# Altium schematic sheet GroundsCoupling.SchDoc: FMC SDR Frontend
size 420 x 297 mm; CheckedBy: -; CompanyName: CERN; DrawnBy: DrawnBy; Organization: CERN; Address1: European Organization for Nuclear Research; Address2: CH-1211 Genčve 23 - Switzerland; Revision: -; SheetNumber: -; SheetTotal: -; EDA_Number: EDA-XXXXX-VX-X; Projet: -; ModifiedBy: -; CreateDate: XX/XX/XXXX; CheckedDate: -; Title2: Grounds and Shield Coupling; DivGrp: TE/MPE; Designer: Designer; ModifiedDate: -
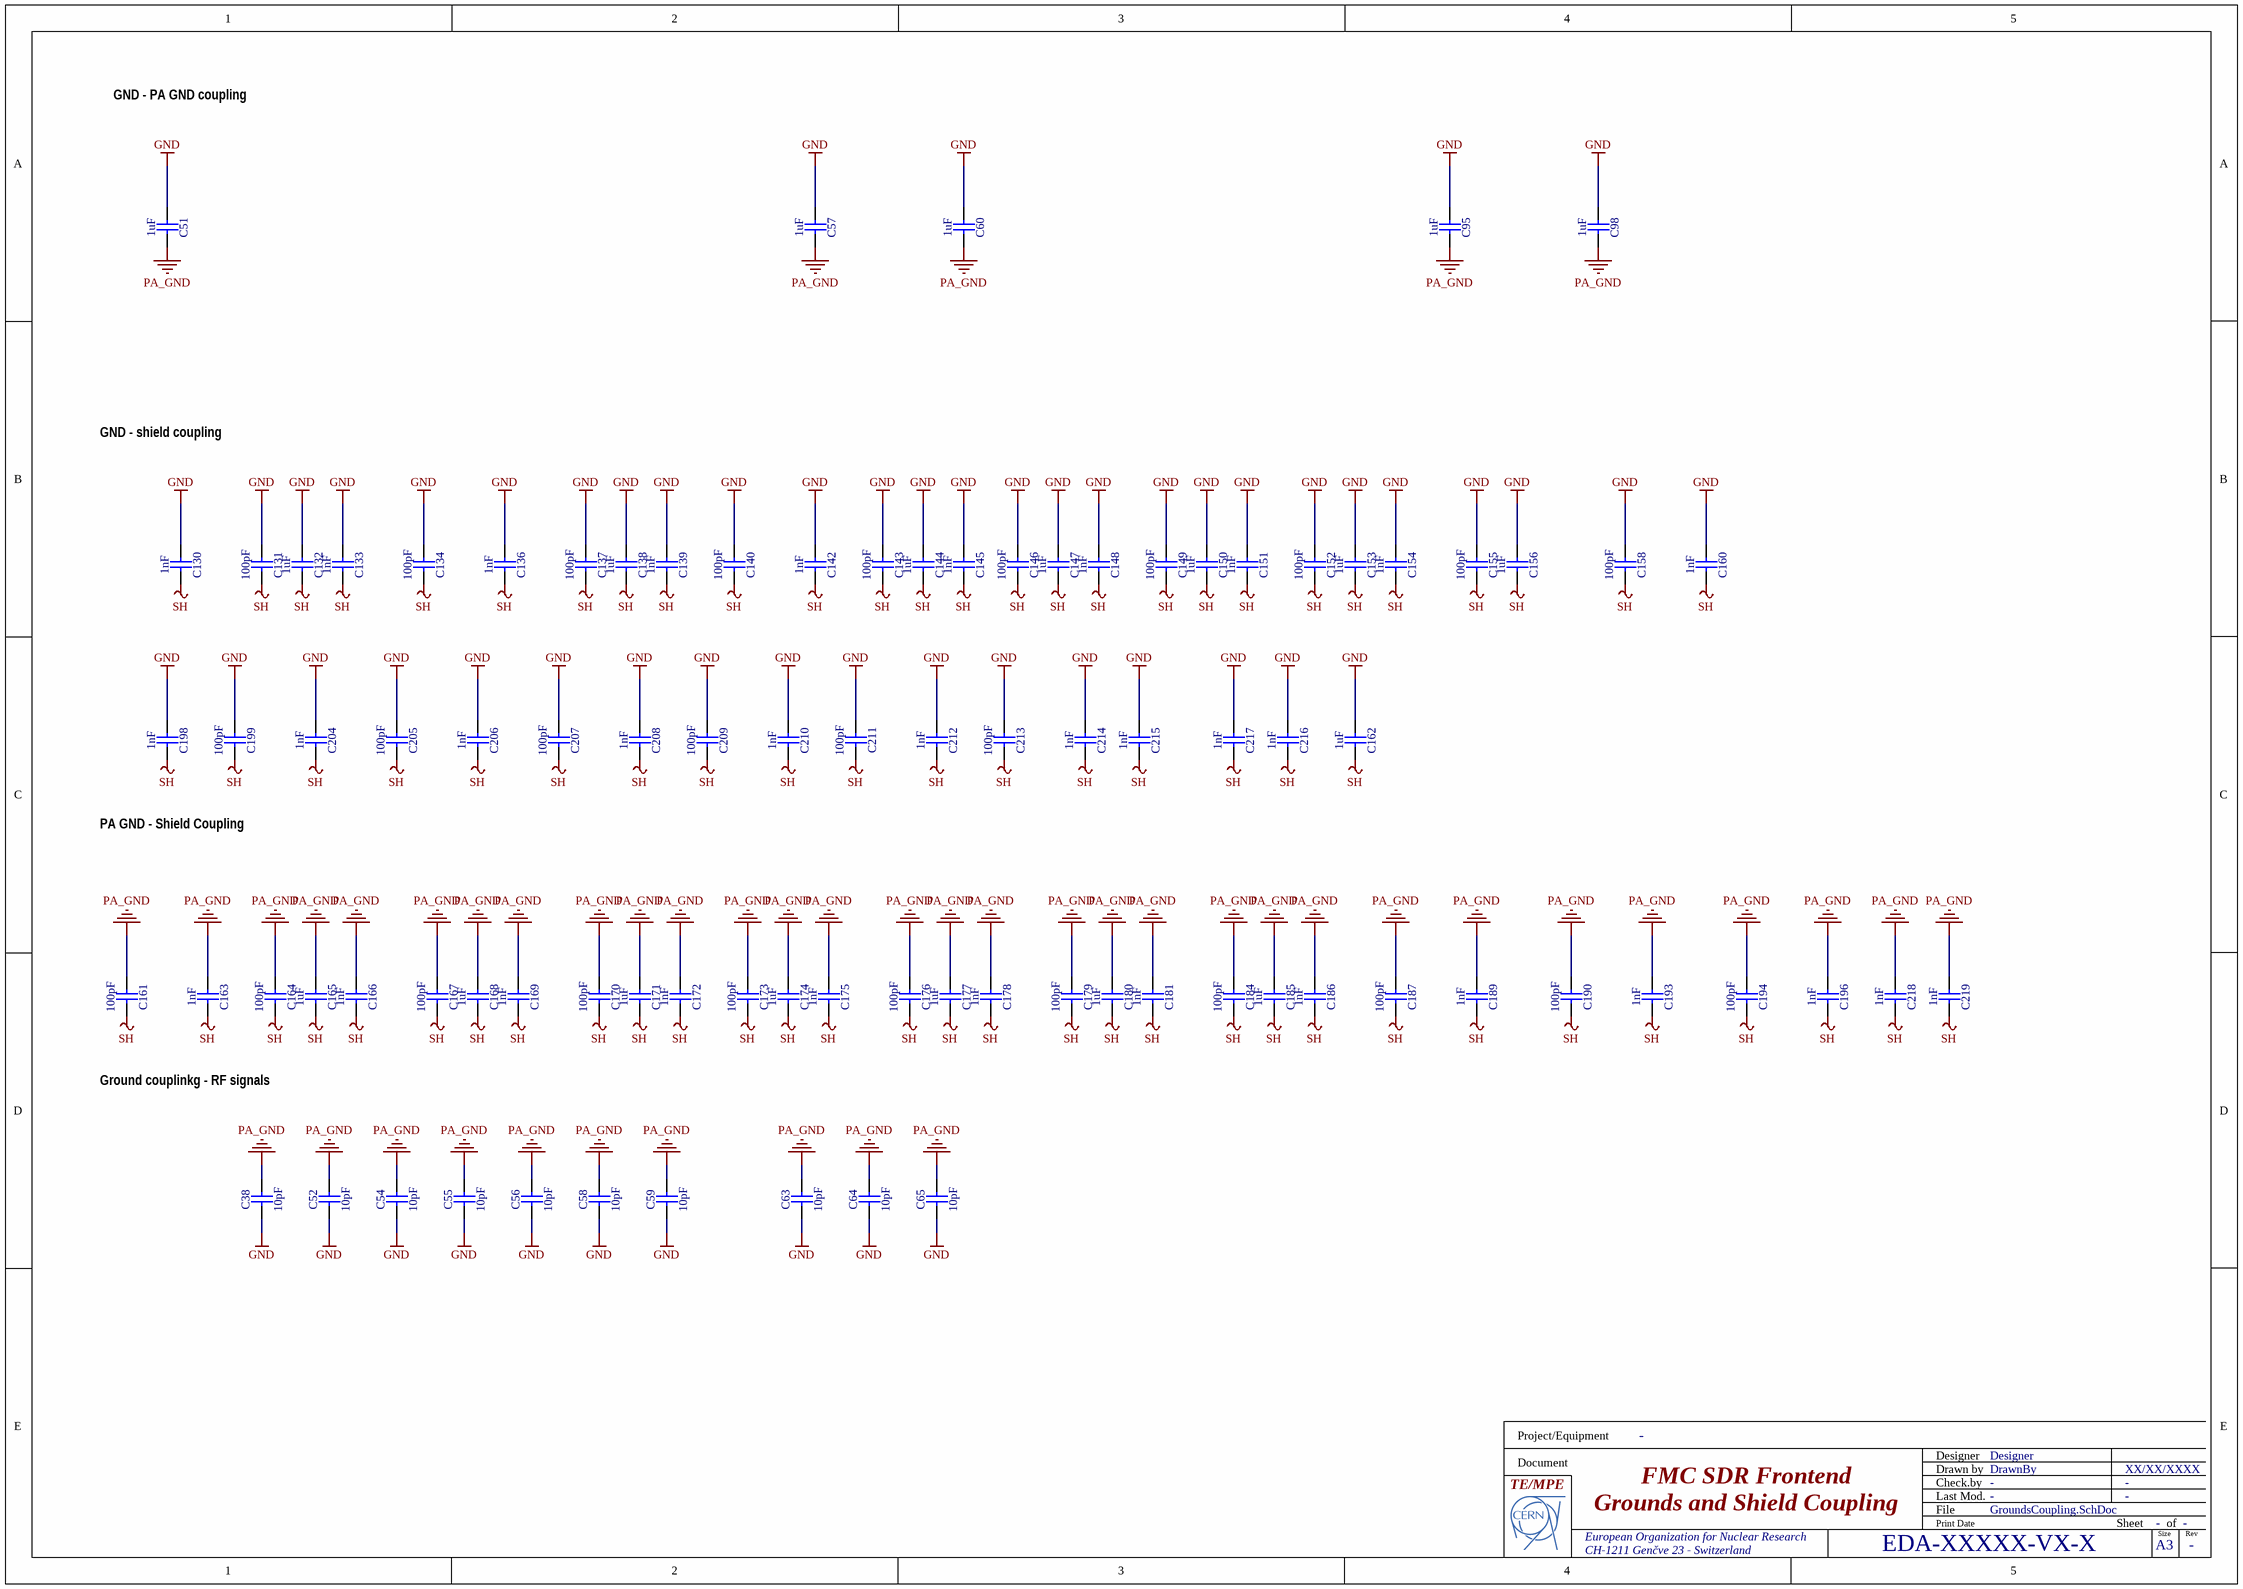
[diagram p0: GroundsCoupling.SchDoc]

## Parts
C38  10pF  [CAPC1005X55N]
C51  1uF  [CAPC3216X140N]
C52  10pF  [CAPC1005X55N]
C54  10pF  [CAPC1005X55N]
C55  10pF  [CAPC1005X55N]
C56  10pF  [CAPC1005X55N]
C57  1uF  [CAPC3216X140N]
C58  10pF  [CAPC1005X55N]
C59  10pF  [CAPC1005X55N]
C60  1uF  [CAPC3216X140N]
C63  10pF  [CAPC1005X55N]
C64  10pF  [CAPC1005X55N]
C65  10pF  [CAPC1005X55N]
C95  1uF  [CAPC3216X140N]
C98  1uF  [CAPC3216X140N]
C130  1nF  [CAPC1005X55N]
C131  100pF  [CAPC1005X55N]
C132  1uF  [CAPC3216X140N]
C133  1nF  [CAPC1005X55N]
C134  100pF  [CAPC1005X55N]
C136  1nF  [CAPC1005X55N]
C137  100pF  [CAPC1005X55N]
C138  1uF  [CAPC3216X140N]
C139  1nF  [CAPC1005X55N]
C140  100pF  [CAPC1005X55N]
C142  1nF  [CAPC1005X55N]
C143  100pF  [CAPC1005X55N]
C144  1uF  [CAPC3216X140N]
C145  1nF  [CAPC1005X55N]
C146  100pF  [CAPC1005X55N]
C147  1uF  [CAPC3216X140N]
C148  1nF  [CAPC1005X55N]
C149  100pF  [CAPC1005X55N]
C150  1uF  [CAPC3216X140N]
C151  1nF  [CAPC1005X55N]
C152  100pF  [CAPC1005X55N]
C153  1uF  [CAPC3216X140N]
C154  1nF  [CAPC1005X55N]
C155  100pF  [CAPC1005X55N]
C156  1uF  [CAPC3216X140N]
C158  100pF  [CAPC1005X55N]
C160  1nF  [CAPC1005X55N]
C161  100pF  [CAPC1005X55N]
C162  1uF  [CAPC3216X140N]
C163  1nF  [CAPC1005X55N]
C164  100pF  [CAPC1005X55N]
C165  1uF  [CAPC3216X140N]
C166  1nF  [CAPC1005X55N]
C167  100pF  [CAPC1005X55N]
C168  1uF  [CAPC3216X140N]
C169  1nF  [CAPC1005X55N]
C170  100pF  [CAPC1005X55N]
C171  1uF  [CAPC3216X140N]
C172  1nF  [CAPC1005X55N]
C173  100pF  [CAPC1005X55N]
C174  1uF  [CAPC3216X140N]
C175  1nF  [CAPC1005X55N]
C176  100pF  [CAPC1005X55N]
C177  1uF  [CAPC3216X140N]
C178  1nF  [CAPC1005X55N]
C179  100pF  [CAPC1005X55N]
C180  1uF  [CAPC3216X140N]
C181  1nF  [CAPC1005X55N]
C184  100pF  [CAPC1005X55N]
C185  1uF  [CAPC3216X140N]
C186  1nF  [CAPC1005X55N]
C187  100pF  [CAPC1005X55N]
C189  1nF  [CAPC1005X55N]
C190  100pF  [CAPC1005X55N]
C193  1nF  [CAPC1005X55N]
C194  100pF  [CAPC1005X55N]
C196  1nF  [CAPC1005X55N]
C198  1nF  [CAPC1005X55N]
C199  100pF  [CAPC1005X55N]
C204  1nF  [CAPC1005X55N]
C205  100pF  [CAPC1005X55N]
C206  1nF  [CAPC1005X55N]
C207  100pF  [CAPC1005X55N]
C208  1nF  [CAPC1005X55N]
C209  100pF  [CAPC1005X55N]
C210  1nF  [CAPC1005X55N]
C211  100pF  [CAPC1005X55N]
C212  1nF  [CAPC1005X55N]
C213  100pF  [CAPC1005X55N]
C214  1nF  [CAPC1005X55N]
C215  1nF  [CAPC1005X55N]
C216  1nF  [CAPC1005X55N]
C217  1nF  [CAPC1005X55N]
C218  1nF  [CAPC1005X55N]
C219  1nF  [CAPC1005X55N]

## Nets
GND: C38.1 C51.1 C52.1 C54.1 C55.1 C56.1 C57.1 C58.1 C59.1 C60.1 C63.1 C64.1 C65.1 C95.1 C98.1 C130.1 C131.1 C132.1 C133.1 C134.1 C136.1 C137.1 C138.1 C139.1 C140.1 C142.1 C143.1 C144.1 C145.1 C146.1 C147.1 C148.1 C149.1 C150.1 C151.1 C152.1 C153.1 C154.1 C155.1 C156.1 C158.1 C160.1 C162.1 C198.1 C199.1 C204.1 C205.1 C206.1 C207.1 C208.1 C209.1 C210.1 C211.1 C212.1 C213.1 C214.1 C215.1 C216.1 C217.1
PA_GND: C38.2 C51.2 C52.2 C54.2 C55.2 C56.2 C57.2 C58.2 C59.2 C60.2 C63.2 C64.2 C65.2 C95.2 C98.2 C161.1 C163.1 C164.1 C165.1 C166.1 C167.1 C168.1 C169.1 C170.1 C171.1 C172.1 C173.1 C174.1 C175.1 C176.1 C177.1 C178.1 C179.1 C180.1 C181.1 C184.1 C185.1 C186.1 C187.1 C189.1 C190.1 C193.1 C194.1 C196.1 C218.1 C219.1
SH: C130.2 C131.2 C132.2 C133.2 C134.2 C136.2 C137.2 C138.2 C139.2 C140.2 C142.2 C143.2 C144.2 C145.2 C146.2 C147.2 C148.2 C149.2 C150.2 C151.2 C152.2 C153.2 C154.2 C155.2 C156.2 C158.2 C160.2 C161.2 C162.2 C163.2 C164.2 C165.2 C166.2 C167.2 C168.2 C169.2 C170.2 C171.2 C172.2 C173.2 C174.2 C175.2 C176.2 C177.2 C178.2 C179.2 C180.2 C181.2 C184.2 C185.2 C186.2 C187.2 C189.2 C190.2 C193.2 C194.2 C196.2 C198.2 C199.2 C204.2 C205.2 C206.2 C207.2 C208.2 C209.2 C210.2 C211.2 C212.2 C213.2 C214.2 C215.2 C216.2 C217.2 C218.2 C219.2

## Notes on the sheet
- GND - PA GND coupling
- GND - shield coupling
- PA GND - Shield Coupling
- Ground couplinkg - RF signals
- Project/Equipment
- Document
- Designer
- Drawn by
- Check.by
- File
- Last Mod.
- Print Date
- Sheet
- Size
- A3
- of
- Rev

## Library data of the parts
C38 C52 C54-C56 C58 C59 C63-C65 = CC0402_10PF_50V_0.5PF_C0G_YUDEN_UMK105CG100DVHF: Non-polarised capacitor; Part Description: SMD Multilayer Ceramic Capacitor (Temperature Compensating Type) for Automotive / Industrial Applications; Manufacturer: TAIYO YUDEN; Voltage: 50V; TC: C0G/NP0; Tolerance: ±0.5pF; Part Number: CC0402_10PF_50V_0.5PF_C0G_YUDEN_UMK105CG100DVHF; Component Kind: Standard; Component Type: Standard; Pin Count: 2; Value: 10pF; Status: Preferred; Manufacturer Part Number: UMK105CG100DVHF; Case: 0402; Mounted: Yes; Socket: No; SMD: Yes; Sense: No; ComponentHeight: 0.55mm; HelpURL: \\cern.ch\dfs\Applications\Altium\Datasheets\CC0402_TAIYO-YUDEN_UMK105CG100DVHF.pdf; Author: CERN DEM JLC; CreateDate: 14.02.2018; LatestRevisionDate: 14.02.2018
C51 C57 C60 C95 C98 C132 C138 C144 C147 C150 C153 C156 C162 C165 C168 C171 C174 C177 C180 C185 = CC1206_1UF_50V_10%_X7R: Non-polarised capacitor; Part Description: SMD Multilayer Chip Ceramic Capacitor; Manufacturer: GENERIC; Manufacturer1 Part Number: C1206F105K5RACTU; Voltage: 50V; TC: X7R; Tolerance: ±10%; Part Number: CC1206_1UF_50V_10%_X7R; Component Kind: Standard; Component Type: Standard; Pin Count: 2; Value: 1uF; Status: Preferred; Manufacturer Part Number: CC1206_1UF_50V_10%_X7R; Case: 1206; Mounted: Yes; Socket: No; SMD: Yes; Sense: No; Manufacturer1 Example: KEMET; Manufacturer1 ComponentHeight: 1.8mm; HelpURL: \\cern.ch\dfs\Applications\Altium\Datasheets\CC1206_X7R_KEMET_OPENMODE.pdf; Author: CERN DEM JLC; CreateDate: 07.11.2012; LatestRevisionDate: 07.11.2012
C130 C133 C136 C139 C142 C145 C148 C151 C154 C160 C163 C166 C169 C172 C175 C178 C181 C186 C189 C193 C196 C198 C204 C206 C208 C210 C212 C214-C219 = CC0402_1NF_50V_10%_X7R: Non-polarised capacitor; Part Description: SMD Multilayer Chip Ceramic Capacitor; Manufacturer: GENERIC; Manufacturer1 Part Number: 223858715623; Voltage: 50V; TC: X7R; Tolerance: ±10%; Part Number: CC0402_1NF_50V_10%_X7R; Component Kind: Standard; Component Type: Standard; Pin Count: 2; Value: 1nF; Status: Not Recommended; Manufacturer Part Number: CC0402_1NF_50V_10%_X7R; Case: 0402; Mounted: Yes; Socket: No; SMD: Yes; Sense: No; Manufacturer1 Example: PHYCOMP; Manufacturer1 ComponentHeight: 0.55mm; HelpURL: \\cern.ch\dfs\Applications\Altium\Datasheets\CC0402_X7R_PHYCOMP.pdf; Author: CERN DEM JLC; CreateDate: 03.12.2007; LatestRevisionDate: 03.12.2007
C131 C134 C137 C140 C143 C146 C149 C152 C155 C158 C161 C164 C167 C170 C173 C176 C179 C184 C187 C190 C194 C199 C205 C207 C209 C211 C213 = CC0402_100PF_50V_5%_C0G: Non-polarised capacitor; Part Description: SMD Multilayer Chip Ceramic Capacitor; Manufacturer: GENERIC; Manufacturer1 Part Number: C0402C101J5GACTU; Voltage: 50V; TC: C0G/NP0; Tolerance: ±5%; Part Number: CC0402_100PF_50V_5%_C0G; Component Kind: Standard; Component Type: Standard; Pin Count: 2; Value: 100pF; Status: Preferred; Manufacturer Part Number: CC0402_100PF_50V_5%_C0G; Case: 0402; Mounted: Yes; Socket: No; SMD: Yes; Sense: No; Manufacturer1 Example: KEMET; Manufacturer1 ComponentHeight: 0.55mm; HelpURL: \\cern.ch\dfs\Applications\Altium\Datasheets\CC0805_C0G_KEMET_(Commercial Grade).pdf; Author: CERN DEM JLC; CreateDate: 03.12.2007; LatestRevisionDate: 22.04.2015